# Altium schematic sheet sensor.SchDoc
size A
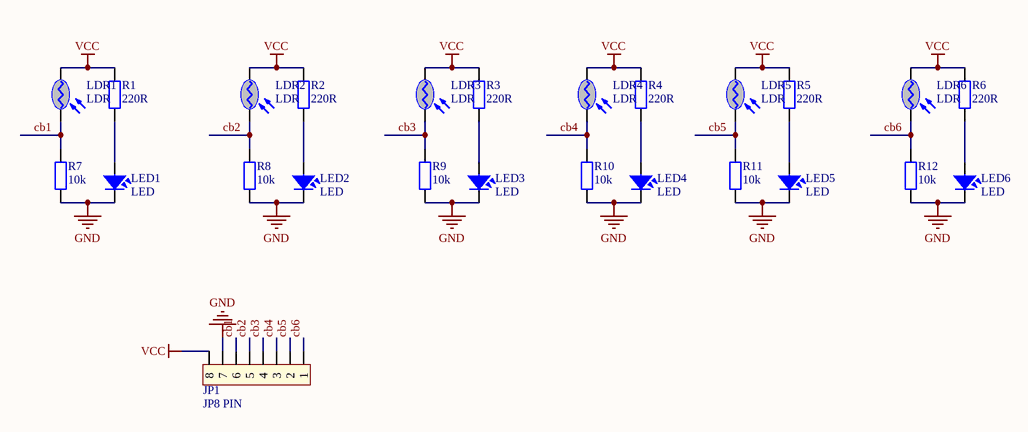
[diagram p0: sensor.SchDoc]

## Parts
JP1  JP8 PIN  [JP8]
LDR1  LDR  [LED-5 GRe]
LDR2  LDR  [LED-5 GRe]
LDR3  LDR  [LED-5 GRe]
LDR4  LDR  [LED-5 GRe]
LDR5  LDR  [LED-5 GRe]
LDR6  LDR  [LED-5 GRe]
LED1  LED  [LED-5TRED]
LED2  LED  [LED-5TRED]
LED3  LED  [LED-5TRED]
LED4  LED  [LED-5TRED]
LED5  LED  [LED-5TRED]
LED6  LED  [LED-5TRED]
R1  220R  [R1/4W]
R2  220R  [R1/4W]
R3  220R  [R1/4W]
R4  220R  [R1/4W]
R5  220R  [R1/4W]
R6  220R  [R1/4W]
R7  10k  [R1/4W]
R8  10k  [R1/4W]
R9  10k  [R1/4W]
R10  10k  [R1/4W]
R11  10k  [R1/4W]
R12  10k  [R1/4W]

## Nets
GND: JP1.7 LED1.2 LED2.2 LED3.2 LED4.2 LED5.2 LED6.2 R7.2 R8.2 R9.2 R10.2 R11.2 R12.2
VCC: JP1.8 LDR1.1(A) LDR2.1(A) LDR3.1(A) LDR4.1(A) LDR5.1(A) LDR6.1(A) R1.1 R2.1 R3.1 R4.1 R5.1 R6.1
cb1: JP1.6 LDR1.2(K) R7.1
cb2: JP1.5 LDR2.2(K) R8.1
cb3: JP1.4 LDR3.2(K) R9.1
cb4: JP1.3 LDR4.2(K) R10.1
cb5: JP1.2 LDR5.2(K) R11.1
cb6: JP1.1 LDR6.2(K) R12.1
NetLED1_1: LED1.1 R1.2
NetLED2_1: LED2.1 R2.2
NetLED3_1: LED3.1 R3.2
NetLED4_1: LED4.1 R4.2
NetLED5_1: LED5.1 R5.2
NetLED6_1: LED6.1 R6.2

## Library data of the parts
JP1 = JP8: Value: JP7
LDR1-LDR6 = LDR: Quang Tro
LED1-LED6 = LED: LED Single colour Green and Red; Value: LED 3 ly Single Colour; Description: LED 5 ly Single Colour; Description: Led  Vuong
R1-R12 = R1/4W: Resistor 1/4W; Value: R1/4W - 1K